# Altium schematic sheet Sheet1.SchDoc
size A; SheetNumber: 1; SheetTotal: 4
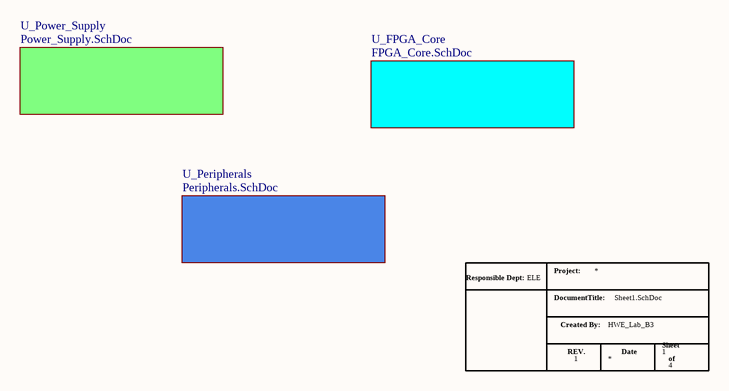
[diagram p0: Sheet1.SchDoc]

## Parts
*  8Bit_CPU  (value not drawn)  (graphical)

## Sub-sheets
U_FPGA_Core = FPGA_Core.SchDoc: no entries
U_Peripherals = Peripherals.SchDoc: no entries
U_Power_Supply = Power_Supply.SchDoc: no entries

## Notes on the sheet
- (in symbol 8Bit_CPU) Project:; Responsible Dept:; ELE; DocumentTitle:; Created By:; HWE_Lab_B3; Sheet; REV.; Date; 1; of